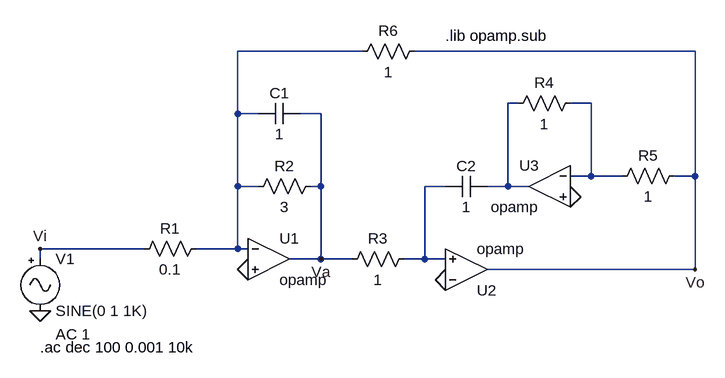
[diagram p0: schematic VoVi.asc]
VoVi.asc, the LTspice schematic file:
Version 4
SHEET 1 880 680
WIRE 192 -240 0 -240
WIRE 704 -240 272 -240
WIRE 432 -160 416 -160
WIRE 544 -160 512 -160
WIRE 0 -144 0 -240
WIRE 32 -144 0 -144
WIRE 128 -144 96 -144
WIRE 544 -48 544 -160
WIRE 544 -48 512 -48
WIRE 592 -48 544 -48
WIRE 704 -48 704 -240
WIRE 704 -48 672 -48
WIRE 0 -32 0 -144
WIRE 32 -32 0 -32
WIRE 128 -32 128 -144
WIRE 128 -32 112 -32
WIRE 320 -32 288 -32
WIRE 416 -32 416 -160
WIRE 416 -32 384 -32
WIRE 448 -32 416 -32
WIRE -144 64 -304 64
WIRE 0 64 0 -32
WIRE 0 64 -64 64
WIRE 16 64 0 64
WIRE -304 80 -304 64
WIRE 128 80 128 -32
WIRE 128 80 80 80
WIRE 176 80 128 80
WIRE 288 80 288 -32
WIRE 288 80 256 80
WIRE 320 80 288 80
WIRE 704 96 704 -48
WIRE 704 96 384 96
FLAG -304 160 0
FLAG 16 96 0
FLAG 320 112 0
FLAG 512 -16 0
FLAG 128 80 Va
FLAG 704 96 Vo
FLAG -304 64 Vi
SYMBOL OpAmps\\opamp 48 16 R0
SYMATTR InstName U1
SYMBOL OpAmps\\opamp 352 160 M180
SYMATTR InstName U2
SYMBOL OpAmps\\opamp 480 -96 M0
SYMATTR InstName U3
SYMBOL res -48 48 R90
WINDOW 0 0 56 VBottom 2
WINDOW 3 32 56 VTop 2
SYMATTR InstName R1
SYMATTR Value 0.1
SYMBOL res 128 -48 R90
WINDOW 0 0 56 VBottom 2
WINDOW 3 32 56 VTop 2
SYMATTR InstName R2
SYMATTR Value 3
SYMBOL cap 32 -128 R270
WINDOW 0 32 32 VTop 2
WINDOW 3 0 32 VBottom 2
SYMATTR InstName C1
SYMATTR Value 1
SYMBOL res 272 64 R90
WINDOW 0 0 56 VBottom 2
WINDOW 3 32 56 VTop 2
SYMATTR InstName R3
SYMATTR Value 1
SYMBOL cap 384 -48 R90
WINDOW 0 0 32 VBottom 2
WINDOW 3 32 32 VTop 2
SYMATTR InstName C2
SYMATTR Value 1
SYMBOL res 528 -176 R90
WINDOW 0 0 56 VBottom 2
WINDOW 3 32 56 VTop 2
SYMATTR InstName R4
SYMATTR Value 1
SYMBOL res 688 -64 R90
WINDOW 0 0 56 VBottom 2
WINDOW 3 32 56 VTop 2
SYMATTR InstName R5
SYMATTR Value 1
SYMBOL res 288 -256 R90
WINDOW 0 0 56 VBottom 2
WINDOW 3 32 56 VTop 2
SYMATTR InstName R6
SYMATTR Value 1
SYMBOL Misc\\signal -304 64 R0
WINDOW 123 24 132 Left 2
WINDOW 39 0 0 Left 0
SYMATTR InstName V1
SYMATTR Value2 AC 1
TEXT 320 -264 Left 2 !.lib opamp.sub
TEXT -304 216 Left 2 !.ac dec 100 0.001 10k

The netlist it stands for:
* VoVi.asc
XU1 N001 0 Va opamp Aol=100K GBW=10Meg  ; pins invin noninvin out
XU2 0 N004 Vo opamp Aol=100K GBW=10Meg  ; pins invin noninvin out
XU3 N003 0 N002 opamp Aol=100K GBW=10Meg  ; pins invin noninvin out
R1 N001 Vi 0.1
R2 Va N001 3
C1 N001 Va 1
R3 N004 Va 1
C2 N002 N004 1
R4 N003 N002 1
R5 Vo N003 1
R6 Vo N001 1
V1 Vi 0 SINE(0 1 1K) AC 1
.lib opamp.sub
.ac dec 100 0.001 10k
.backanno
.end

* Results of the author's LTspice run, read from the files saved beside the schematic
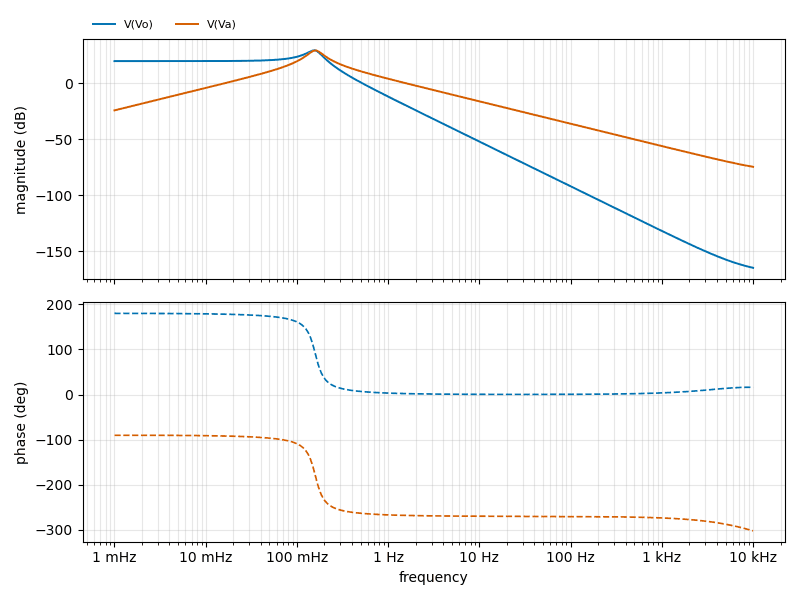
[diagram p1: AC Analysis of VoVi.asc, plotted from the saved traces]
* AC Analysis, 1 run:
*   V(Vo): 20.00 dB at 1 mHz, -164.79 dB at 10 kHz, peak 29.66 dB at 154.9 mHz, 3 dB below the peak at 124.8 mHz and 179.6 mHz
*   V(Va): -24.04 dB at 1 mHz, -74.52 dB at 10 kHz, peak 29.53 dB at 158.5 mHz, 3 dB below the peak at 134.8 mHz and 187.9 mHz